# EasyEDA Pro project Charger Splitter.eprj, schematic Schematic3

## Sheets
1 P1: Board Name: Board3; Create Date: 2025-09-04; Page Name: P3; Project Name: Charger Splitter; Schematic Name: Schematic3; Update Date: 2025-09-05; Company: EasyEDA.com; Page Size: A4; Version: V1.0
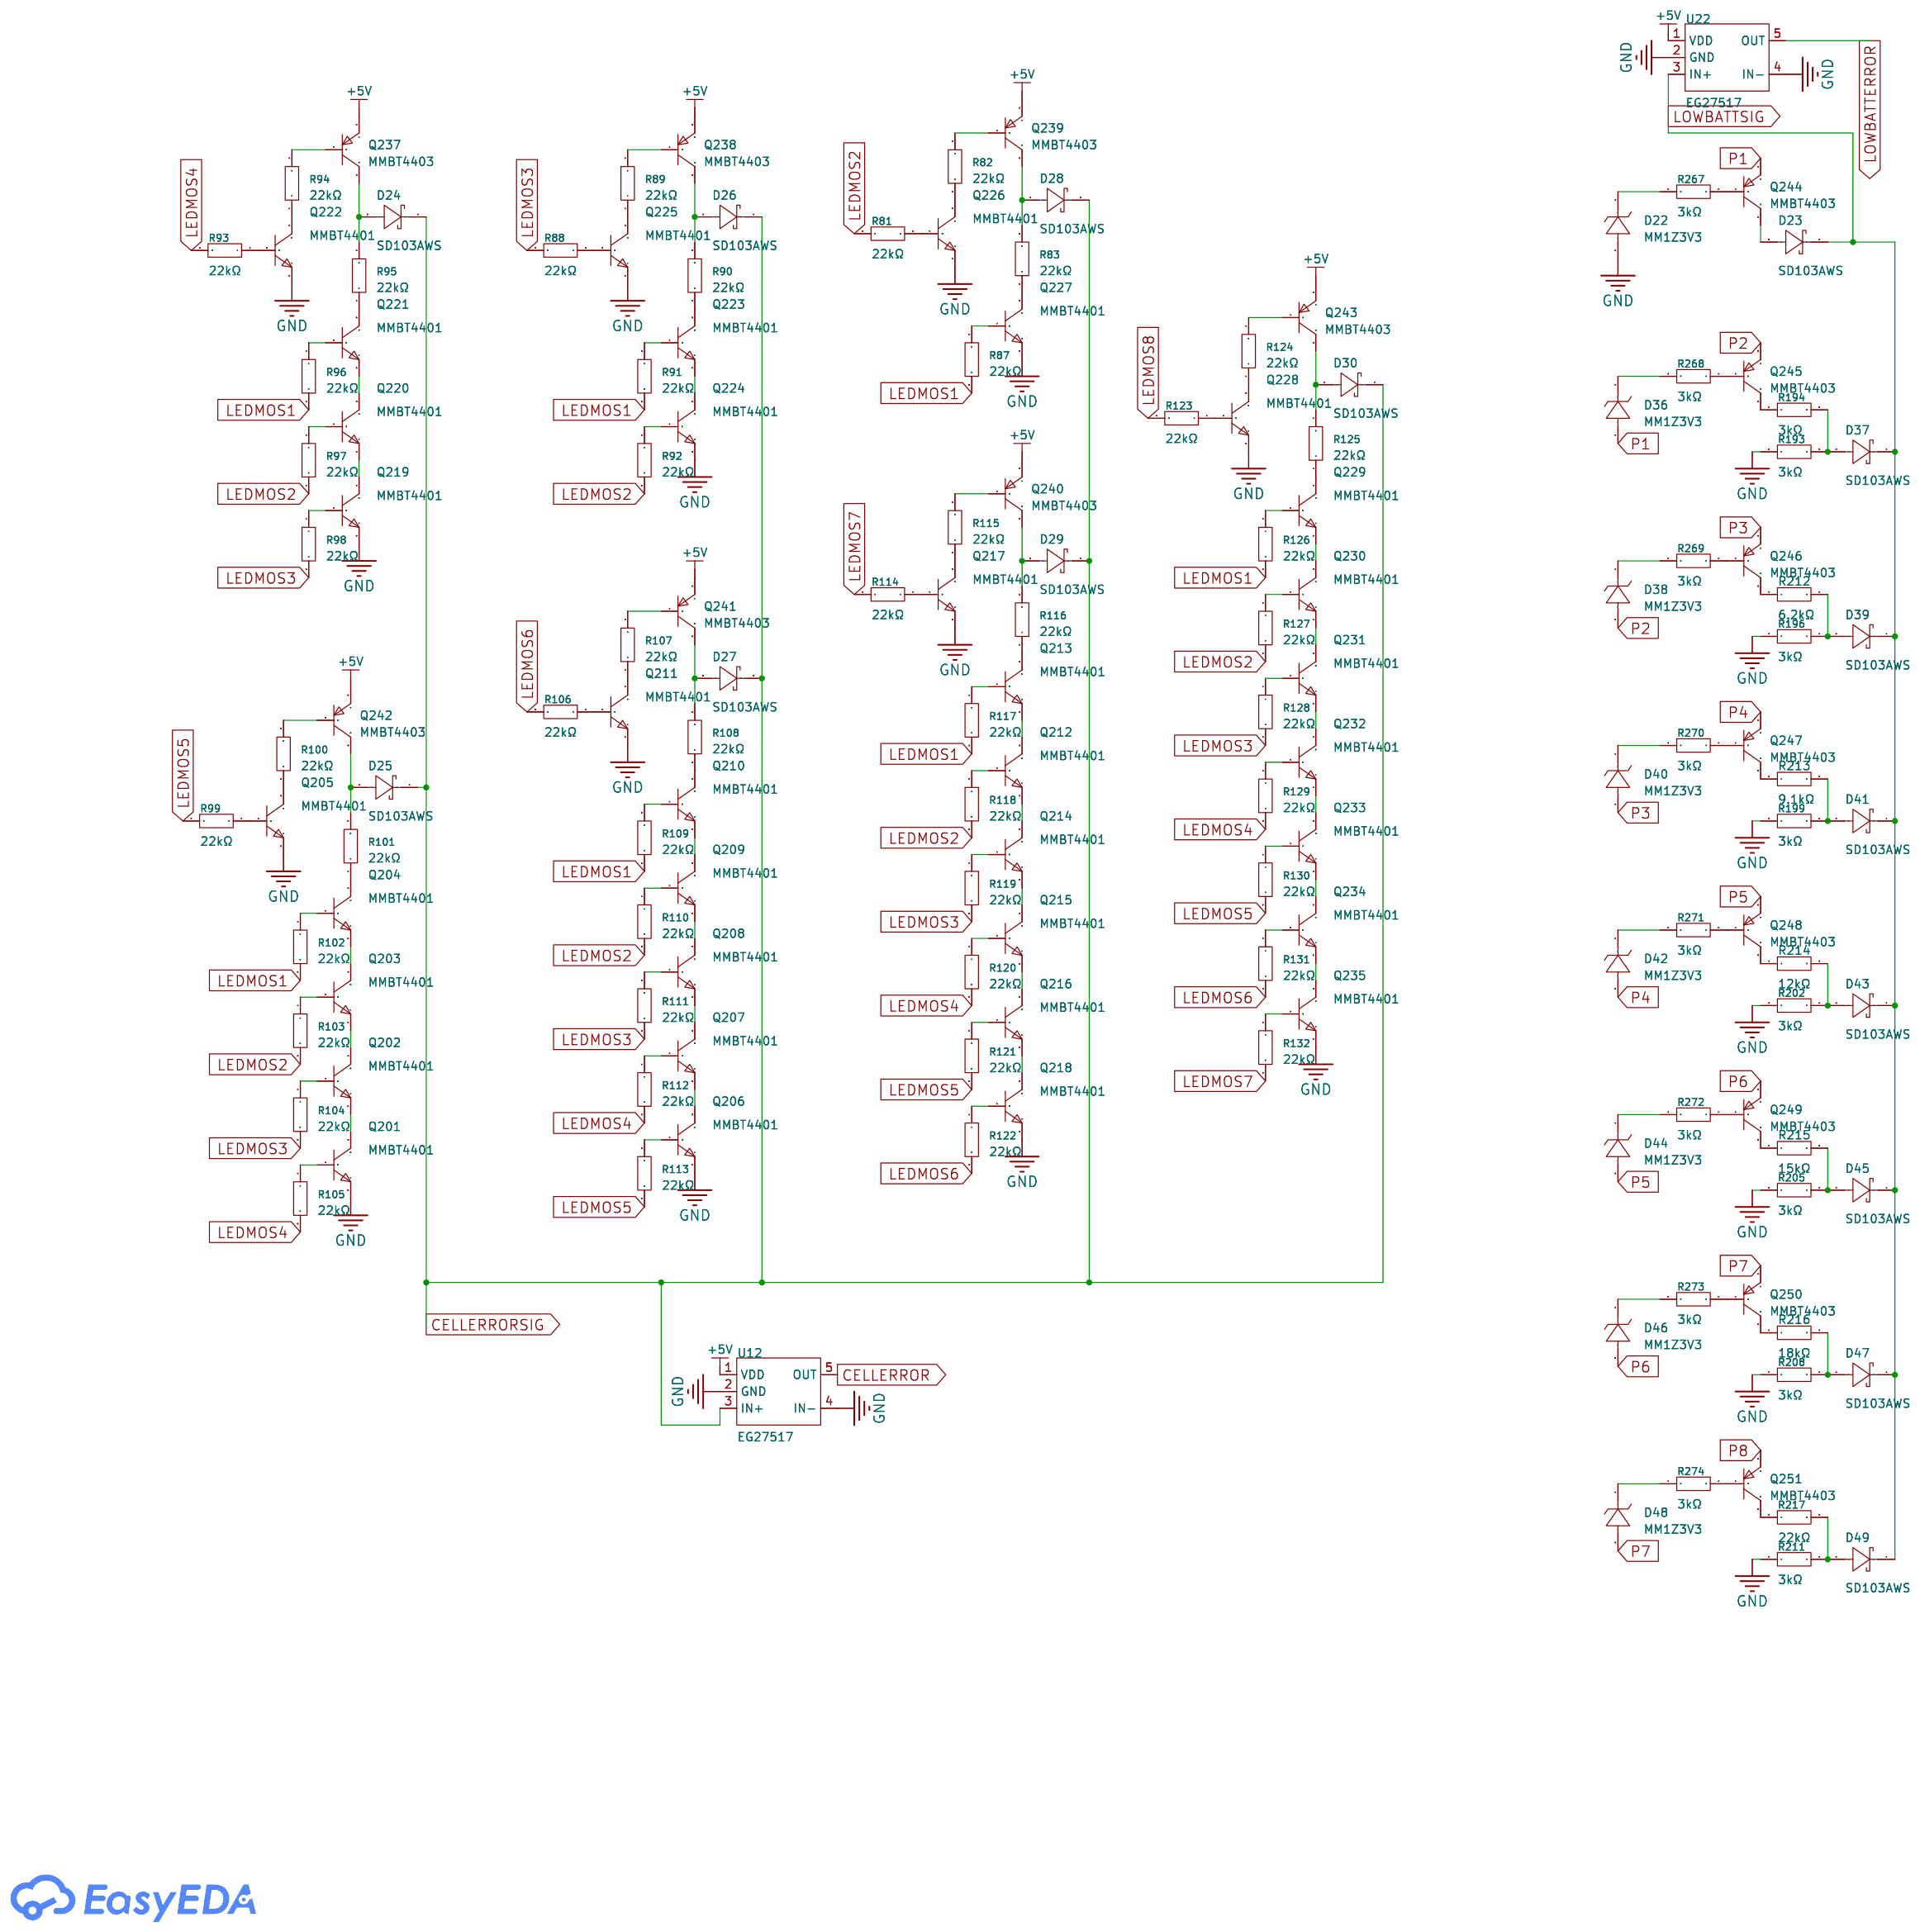
[diagram p2: P1]
2 P2: Page Name: P2; Update Date: 2025-09-13
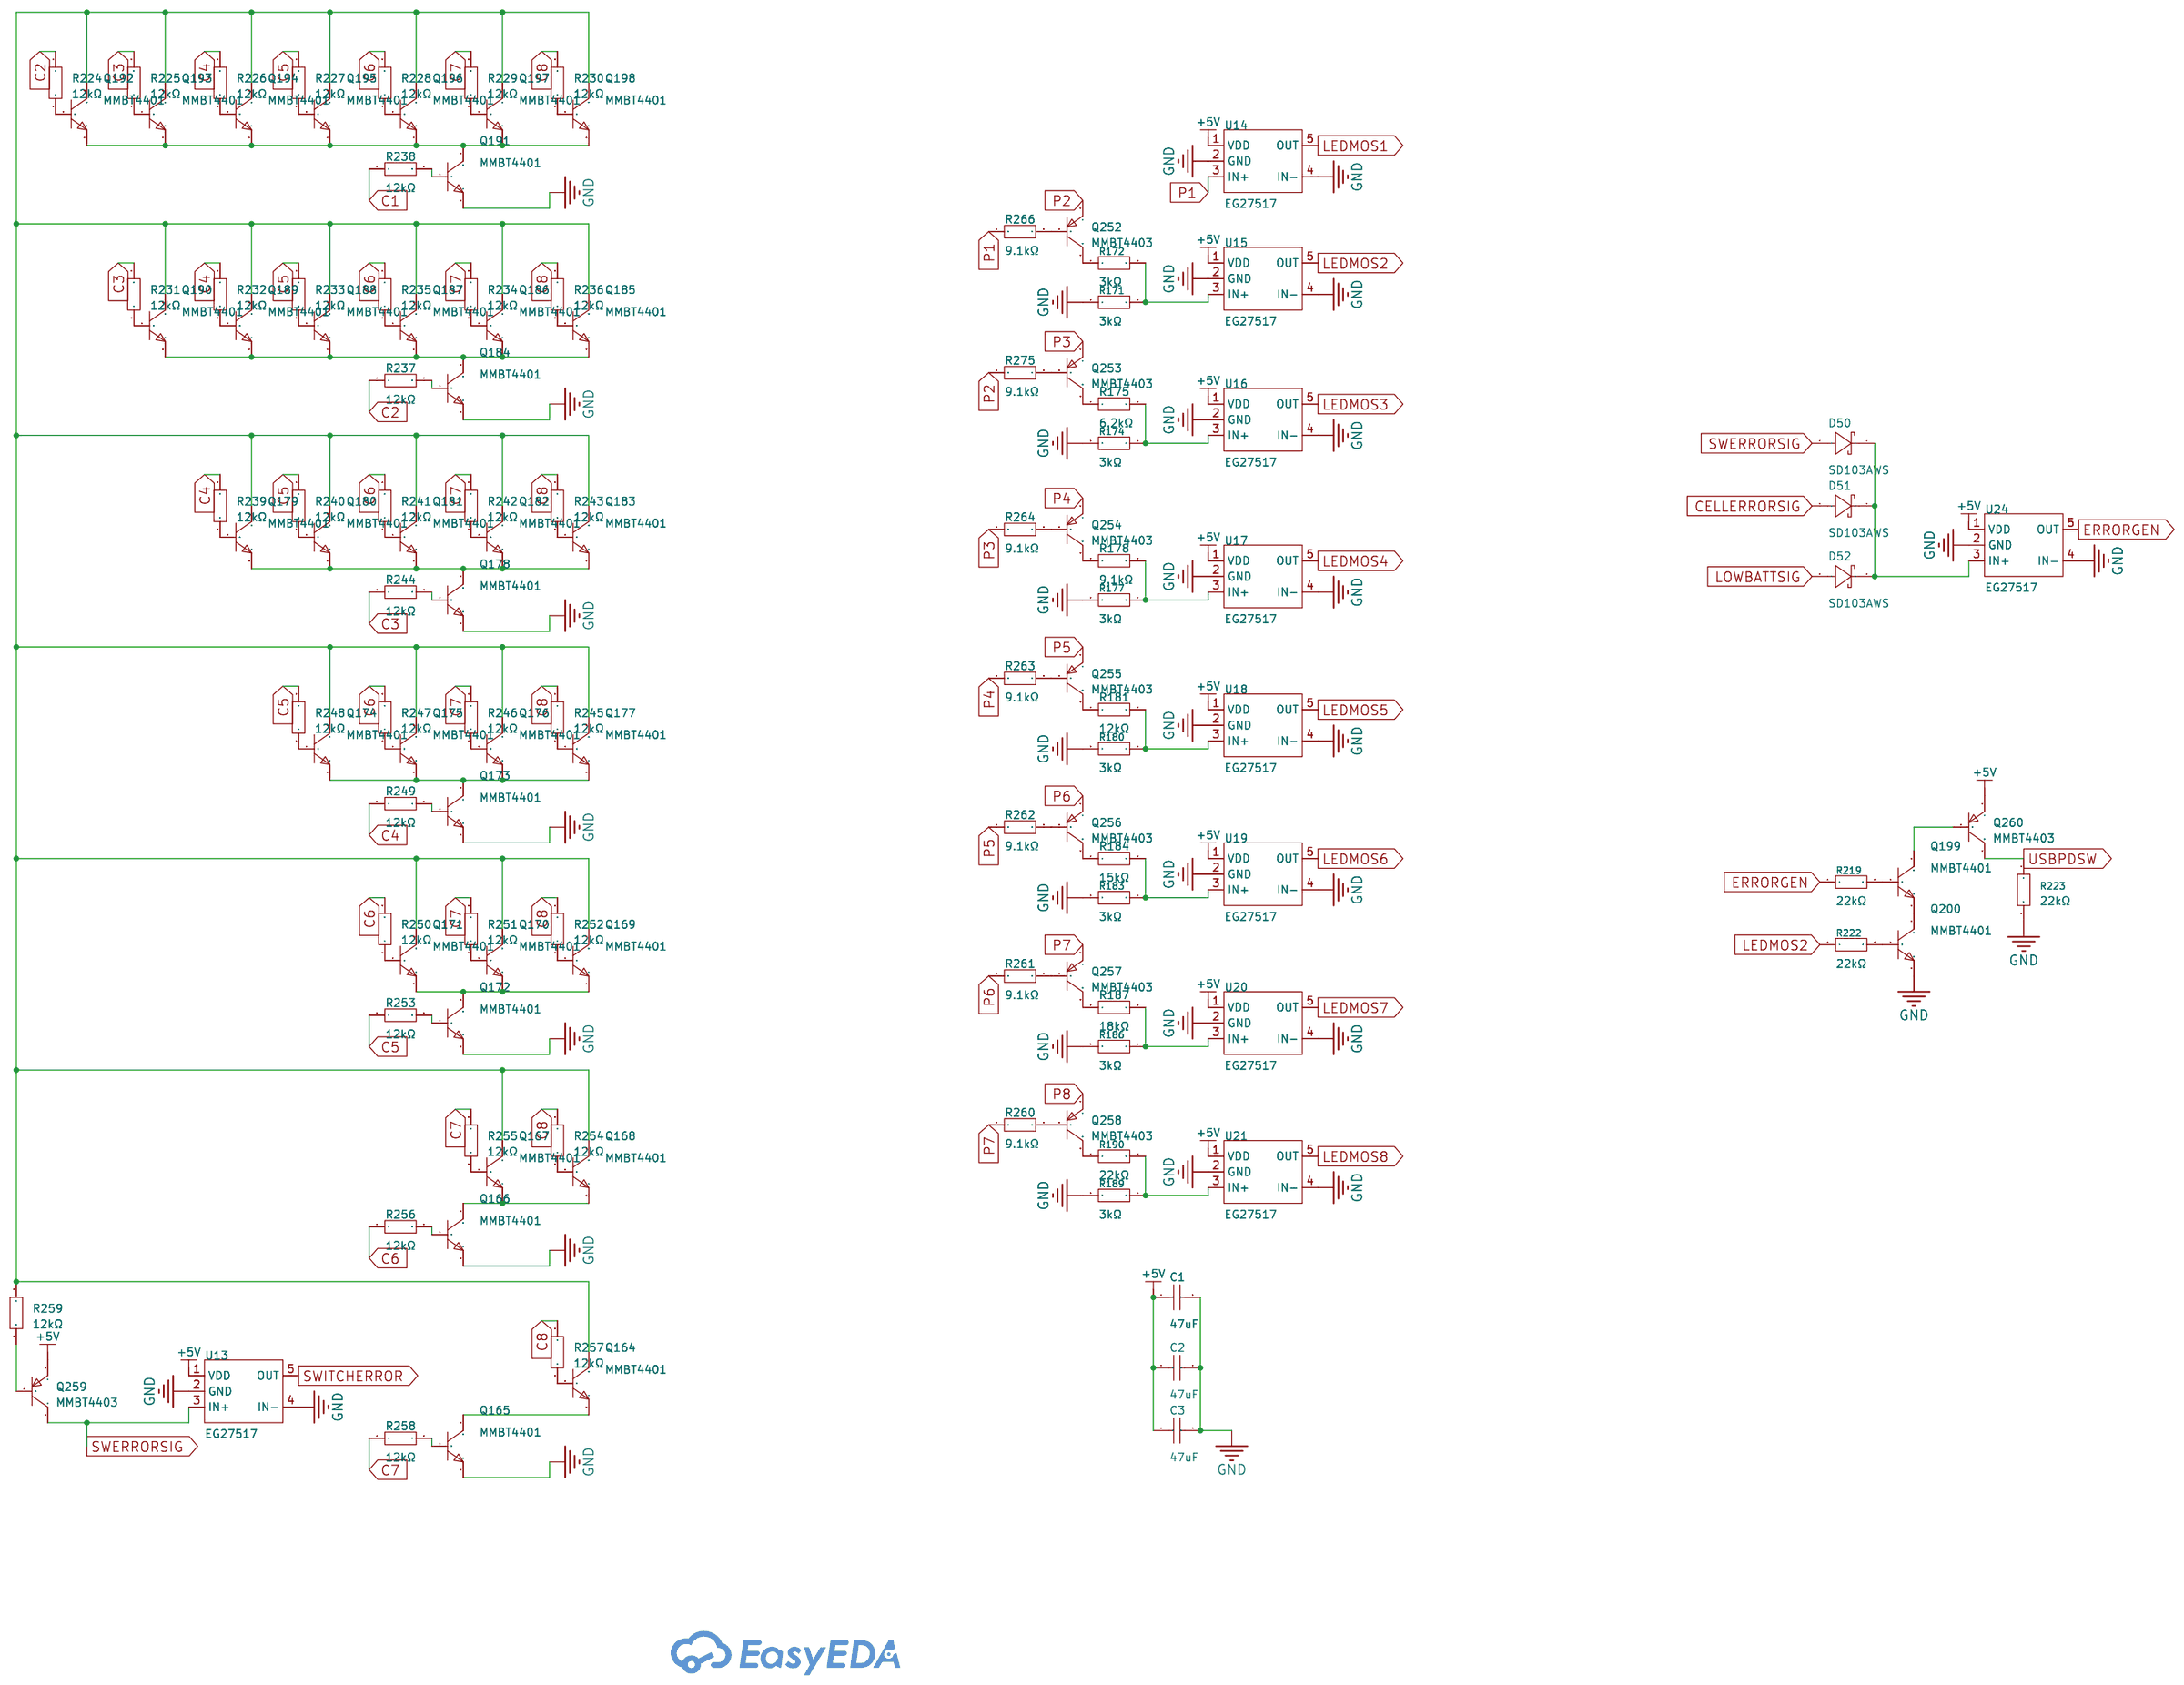
[diagram p3: P2]

## Parts
sheet P1
D22  MM1Z3V3  [SOD-123_L2.7-W1.6-LS3.7-RD]
D23  SD103AWS  [SOD-323_L1.7-W1.3-LS2.6-RD-1]
D24  SD103AWS  [SOD-323_L1.7-W1.3-LS2.6-RD-1]
D25  SD103AWS  [SOD-323_L1.7-W1.3-LS2.6-RD-1]
D26  SD103AWS  [SOD-323_L1.7-W1.3-LS2.6-RD-1]
D27  SD103AWS  [SOD-323_L1.7-W1.3-LS2.6-RD-1]
D28  SD103AWS  [SOD-323_L1.7-W1.3-LS2.6-RD-1]
D29  SD103AWS  [SOD-323_L1.7-W1.3-LS2.6-RD-1]
D30  SD103AWS  [SOD-323_L1.7-W1.3-LS2.6-RD-1]
D36  MM1Z3V3  [SOD-123_L2.7-W1.6-LS3.7-RD]
D37  SD103AWS  [SOD-323_L1.7-W1.3-LS2.6-RD-1]
D38  MM1Z3V3  [SOD-123_L2.7-W1.6-LS3.7-RD]
D39  SD103AWS  [SOD-323_L1.7-W1.3-LS2.6-RD-1]
D40  MM1Z3V3  [SOD-123_L2.7-W1.6-LS3.7-RD]
D41  SD103AWS  [SOD-323_L1.7-W1.3-LS2.6-RD-1]
D42  MM1Z3V3  [SOD-123_L2.7-W1.6-LS3.7-RD]
D43  SD103AWS  [SOD-323_L1.7-W1.3-LS2.6-RD-1]
D44  MM1Z3V3  [SOD-123_L2.7-W1.6-LS3.7-RD]
D45  SD103AWS  [SOD-323_L1.7-W1.3-LS2.6-RD-1]
D46  MM1Z3V3  [SOD-123_L2.7-W1.6-LS3.7-RD]
D47  SD103AWS  [SOD-323_L1.7-W1.3-LS2.6-RD-1]
D48  MM1Z3V3  [SOD-123_L2.7-W1.6-LS3.7-RD]
D49  SD103AWS  [SOD-323_L1.7-W1.3-LS2.6-RD-1]
Q201  MMBT4401  [SOT-23-3_L2.9-W1.3-P1.90-LS2.4-BR]
Q202  MMBT4401  [SOT-23-3_L2.9-W1.3-P1.90-LS2.4-BR]
Q203  MMBT4401  [SOT-23-3_L2.9-W1.3-P1.90-LS2.4-BR]
Q204  MMBT4401  [SOT-23-3_L2.9-W1.3-P1.90-LS2.4-BR]
Q205  MMBT4401  [SOT-23-3_L2.9-W1.3-P1.90-LS2.4-BR]
Q206  MMBT4401  [SOT-23-3_L2.9-W1.3-P1.90-LS2.4-BR]
Q207  MMBT4401  [SOT-23-3_L2.9-W1.3-P1.90-LS2.4-BR]
Q208  MMBT4401  [SOT-23-3_L2.9-W1.3-P1.90-LS2.4-BR]
Q209  MMBT4401  [SOT-23-3_L2.9-W1.3-P1.90-LS2.4-BR]
Q210  MMBT4401  [SOT-23-3_L2.9-W1.3-P1.90-LS2.4-BR]
Q211  MMBT4401  [SOT-23-3_L2.9-W1.3-P1.90-LS2.4-BR]
Q212  MMBT4401  [SOT-23-3_L2.9-W1.3-P1.90-LS2.4-BR]
Q213  MMBT4401  [SOT-23-3_L2.9-W1.3-P1.90-LS2.4-BR]
Q214  MMBT4401  [SOT-23-3_L2.9-W1.3-P1.90-LS2.4-BR]
Q215  MMBT4401  [SOT-23-3_L2.9-W1.3-P1.90-LS2.4-BR]
Q216  MMBT4401  [SOT-23-3_L2.9-W1.3-P1.90-LS2.4-BR]
Q217  MMBT4401  [SOT-23-3_L2.9-W1.3-P1.90-LS2.4-BR]
Q218  MMBT4401  [SOT-23-3_L2.9-W1.3-P1.90-LS2.4-BR]
Q219  MMBT4401  [SOT-23-3_L2.9-W1.3-P1.90-LS2.4-BR]
Q220  MMBT4401  [SOT-23-3_L2.9-W1.3-P1.90-LS2.4-BR]
Q221  MMBT4401  [SOT-23-3_L2.9-W1.3-P1.90-LS2.4-BR]
Q222  MMBT4401  [SOT-23-3_L2.9-W1.3-P1.90-LS2.4-BR]
Q223  MMBT4401  [SOT-23-3_L2.9-W1.3-P1.90-LS2.4-BR]
Q224  MMBT4401  [SOT-23-3_L2.9-W1.3-P1.90-LS2.4-BR]
Q225  MMBT4401  [SOT-23-3_L2.9-W1.3-P1.90-LS2.4-BR]
Q226  MMBT4401  [SOT-23-3_L2.9-W1.3-P1.90-LS2.4-BR]
Q227  MMBT4401  [SOT-23-3_L2.9-W1.3-P1.90-LS2.4-BR]
Q228  MMBT4401  [SOT-23-3_L2.9-W1.3-P1.90-LS2.4-BR]
Q229  MMBT4401  [SOT-23-3_L2.9-W1.3-P1.90-LS2.4-BR]
Q230  MMBT4401  [SOT-23-3_L2.9-W1.3-P1.90-LS2.4-BR]
Q231  MMBT4401  [SOT-23-3_L2.9-W1.3-P1.90-LS2.4-BR]
Q232  MMBT4401  [SOT-23-3_L2.9-W1.3-P1.90-LS2.4-BR]
Q233  MMBT4401  [SOT-23-3_L2.9-W1.3-P1.90-LS2.4-BR]
Q234  MMBT4401  [SOT-23-3_L2.9-W1.3-P1.90-LS2.4-BR]
Q235  MMBT4401  [SOT-23-3_L2.9-W1.3-P1.90-LS2.4-BR]
Q237  MMBT4403  [SOT-23-3_L2.9-W1.3-P0.95-LS2.4-BR]
Q238  MMBT4403  [SOT-23-3_L2.9-W1.3-P0.95-LS2.4-BR]
Q239  MMBT4403  [SOT-23-3_L2.9-W1.3-P0.95-LS2.4-BR]
Q240  MMBT4403  [SOT-23-3_L2.9-W1.3-P0.95-LS2.4-BR]
Q241  MMBT4403  [SOT-23-3_L2.9-W1.3-P0.95-LS2.4-BR]
Q242  MMBT4403  [SOT-23-3_L2.9-W1.3-P0.95-LS2.4-BR]
Q243  MMBT4403  [SOT-23-3_L2.9-W1.3-P0.95-LS2.4-BR]
Q244  MMBT4403  [SOT-23-3_L2.9-W1.3-P0.95-LS2.4-BR]
Q245  MMBT4403  [SOT-23-3_L2.9-W1.3-P0.95-LS2.4-BR]
Q246  MMBT4403  [SOT-23-3_L2.9-W1.3-P0.95-LS2.4-BR]
Q247  MMBT4403  [SOT-23-3_L2.9-W1.3-P0.95-LS2.4-BR]
Q248  MMBT4403  [SOT-23-3_L2.9-W1.3-P0.95-LS2.4-BR]
Q249  MMBT4403  [SOT-23-3_L2.9-W1.3-P0.95-LS2.4-BR]
Q250  MMBT4403  [SOT-23-3_L2.9-W1.3-P0.95-LS2.4-BR]
Q251  MMBT4403  [SOT-23-3_L2.9-W1.3-P0.95-LS2.4-BR]
R81  22kΩ  [R0603]
R82  22kΩ  [R0603]
R83  22kΩ  [R0603]
R87  22kΩ  [R0603]
R88  22kΩ  [R0603]
R89  22kΩ  [R0603]
R90  22kΩ  [R0603]
R91  22kΩ  [R0603]
R92  22kΩ  [R0603]
R93  22kΩ  [R0603]
R94  22kΩ  [R0603]
R95  22kΩ  [R0603]
R96  22kΩ  [R0603]
R97  22kΩ  [R0603]
R98  22kΩ  [R0603]
R99  22kΩ  [R0603]
R100  22kΩ  [R0603]
R101  22kΩ  [R0603]
R102  22kΩ  [R0603]
R103  22kΩ  [R0603]
R104  22kΩ  [R0603]
R105  22kΩ  [R0603]
R106  22kΩ  [R0603]
R107  22kΩ  [R0603]
R108  22kΩ  [R0603]
R109  22kΩ  [R0603]
R110  22kΩ  [R0603]
R111  22kΩ  [R0603]
R112  22kΩ  [R0603]
R113  22kΩ  [R0603]
R114  22kΩ  [R0603]
R115  22kΩ  [R0603]
R116  22kΩ  [R0603]
R117  22kΩ  [R0603]
R118  22kΩ  [R0603]
R119  22kΩ  [R0603]
R120  22kΩ  [R0603]
R121  22kΩ  [R0603]
R122  22kΩ  [R0603]
R123  22kΩ  [R0603]
R124  22kΩ  [R0603]
R125  22kΩ  [R0603]
R126  22kΩ  [R0603]
R127  22kΩ  [R0603]
R128  22kΩ  [R0603]
R129  22kΩ  [R0603]
R130  22kΩ  [R0603]
R131  22kΩ  [R0603]
R132  22kΩ  [R0603]
R193  3kΩ  [R0603]
R194  3kΩ  [R0603]
R196  3kΩ  [R0603]
R199  3kΩ  [R0603]
R202  3kΩ  [R0603]
R205  3kΩ  [R0603]
R208  3kΩ  [R0603]
R211  3kΩ  [R0603]
R212  6.2kΩ  [R0603]
R213  9.1kΩ  [R0603]
R214  12kΩ  [R0603]
R215  15kΩ  [R0603]
R216  18kΩ  [R0603]
R217  22kΩ  [R0603]
R267  3kΩ  [R0603]
R268  3kΩ  [R0603]
R269  3kΩ  [R0603]
R270  3kΩ  [R0603]
R271  3kΩ  [R0603]
R272  3kΩ  [R0603]
R273  3kΩ  [R0603]
R274  3kΩ  [R0603]
U12  EG27517  [SOT-23-5_L2.9-W1.6-P0.95-LS2.8-BR]
U22  EG27517  [SOT-23-5_L2.9-W1.6-P0.95-LS2.8-BR]
sheet P2
C1  47uF  [C0805]
C2  47uF  [C0805]
C3  47uF  [C0805]
D50  SD103AWS  [SOD-323_L1.7-W1.3-LS2.6-RD-1]
D51  SD103AWS  [SOD-323_L1.7-W1.3-LS2.6-RD-1]
D52  SD103AWS  [SOD-323_L1.7-W1.3-LS2.6-RD-1]
Q164  MMBT4401  [SOT-23-3_L2.9-W1.3-P1.90-LS2.4-BR]
Q165  MMBT4401  [SOT-23-3_L2.9-W1.3-P1.90-LS2.4-BR]
Q166  MMBT4401  [SOT-23-3_L2.9-W1.3-P1.90-LS2.4-BR]
Q167  MMBT4401  [SOT-23-3_L2.9-W1.3-P1.90-LS2.4-BR]
Q168  MMBT4401  [SOT-23-3_L2.9-W1.3-P1.90-LS2.4-BR]
Q169  MMBT4401  [SOT-23-3_L2.9-W1.3-P1.90-LS2.4-BR]
Q170  MMBT4401  [SOT-23-3_L2.9-W1.3-P1.90-LS2.4-BR]
Q171  MMBT4401  [SOT-23-3_L2.9-W1.3-P1.90-LS2.4-BR]
Q172  MMBT4401  [SOT-23-3_L2.9-W1.3-P1.90-LS2.4-BR]
Q173  MMBT4401  [SOT-23-3_L2.9-W1.3-P1.90-LS2.4-BR]
Q174  MMBT4401  [SOT-23-3_L2.9-W1.3-P1.90-LS2.4-BR]
Q175  MMBT4401  [SOT-23-3_L2.9-W1.3-P1.90-LS2.4-BR]
Q176  MMBT4401  [SOT-23-3_L2.9-W1.3-P1.90-LS2.4-BR]
Q177  MMBT4401  [SOT-23-3_L2.9-W1.3-P1.90-LS2.4-BR]
Q178  MMBT4401  [SOT-23-3_L2.9-W1.3-P1.90-LS2.4-BR]
Q179  MMBT4401  [SOT-23-3_L2.9-W1.3-P1.90-LS2.4-BR]
Q180  MMBT4401  [SOT-23-3_L2.9-W1.3-P1.90-LS2.4-BR]
Q181  MMBT4401  [SOT-23-3_L2.9-W1.3-P1.90-LS2.4-BR]
Q182  MMBT4401  [SOT-23-3_L2.9-W1.3-P1.90-LS2.4-BR]
Q183  MMBT4401  [SOT-23-3_L2.9-W1.3-P1.90-LS2.4-BR]
Q184  MMBT4401  [SOT-23-3_L2.9-W1.3-P1.90-LS2.4-BR]
Q185  MMBT4401  [SOT-23-3_L2.9-W1.3-P1.90-LS2.4-BR]
Q186  MMBT4401  [SOT-23-3_L2.9-W1.3-P1.90-LS2.4-BR]
Q187  MMBT4401  [SOT-23-3_L2.9-W1.3-P1.90-LS2.4-BR]
Q188  MMBT4401  [SOT-23-3_L2.9-W1.3-P1.90-LS2.4-BR]
Q189  MMBT4401  [SOT-23-3_L2.9-W1.3-P1.90-LS2.4-BR]
Q190  MMBT4401  [SOT-23-3_L2.9-W1.3-P1.90-LS2.4-BR]
Q191  MMBT4401  [SOT-23-3_L2.9-W1.3-P1.90-LS2.4-BR]
Q192  MMBT4401  [SOT-23-3_L2.9-W1.3-P1.90-LS2.4-BR]
Q193  MMBT4401  [SOT-23-3_L2.9-W1.3-P1.90-LS2.4-BR]
Q194  MMBT4401  [SOT-23-3_L2.9-W1.3-P1.90-LS2.4-BR]
Q195  MMBT4401  [SOT-23-3_L2.9-W1.3-P1.90-LS2.4-BR]
Q196  MMBT4401  [SOT-23-3_L2.9-W1.3-P1.90-LS2.4-BR]
Q197  MMBT4401  [SOT-23-3_L2.9-W1.3-P1.90-LS2.4-BR]
Q198  MMBT4401  [SOT-23-3_L2.9-W1.3-P1.90-LS2.4-BR]
Q199  MMBT4401  [SOT-23-3_L2.9-W1.3-P1.90-LS2.4-BR]
Q200  MMBT4401  [SOT-23-3_L2.9-W1.3-P1.90-LS2.4-BR]
Q252  MMBT4403  [SOT-23-3_L2.9-W1.3-P0.95-LS2.4-BR]
Q253  MMBT4403  [SOT-23-3_L2.9-W1.3-P0.95-LS2.4-BR]
Q254  MMBT4403  [SOT-23-3_L2.9-W1.3-P0.95-LS2.4-BR]
Q255  MMBT4403  [SOT-23-3_L2.9-W1.3-P0.95-LS2.4-BR]
Q256  MMBT4403  [SOT-23-3_L2.9-W1.3-P0.95-LS2.4-BR]
Q257  MMBT4403  [SOT-23-3_L2.9-W1.3-P0.95-LS2.4-BR]
Q258  MMBT4403  [SOT-23-3_L2.9-W1.3-P0.95-LS2.4-BR]
Q259  MMBT4403  [SOT-23-3_L2.9-W1.3-P0.95-LS2.4-BR]
Q260  MMBT4403  [SOT-23-3_L2.9-W1.3-P0.95-LS2.4-BR]
R171  3kΩ  [R0603]
R172  3kΩ  [R0603]
R174  3kΩ  [R0603]
R175  6.2kΩ  [R0603]
R177  3kΩ  [R0603]
R178  9.1kΩ  [R0603]
R180  3kΩ  [R0603]
R181  12kΩ  [R0603]
R183  3kΩ  [R0603]
R184  15kΩ  [R0603]
R186  3kΩ  [R0603]
R187  18kΩ  [R0603]
R189  3kΩ  [R0603]
R190  22kΩ  [R0603]
R219  22kΩ  [R0603]
R222  22kΩ  [R0603]
R223  22kΩ  [R0603]
R224  12kΩ  [R0603]
R225  12kΩ  [R0603]
R226  12kΩ  [R0603]
R227  12kΩ  [R0603]
R228  12kΩ  [R0603]
R229  12kΩ  [R0603]
R230  12kΩ  [R0603]
R231  12kΩ  [R0603]
R232  12kΩ  [R0603]
R233  12kΩ  [R0603]
R234  12kΩ  [R0603]
R235  12kΩ  [R0603]
R236  12kΩ  [R0603]
R237  12kΩ  [R0603]
R238  12kΩ  [R0603]
R239  12kΩ  [R0603]
R240  12kΩ  [R0603]
R241  12kΩ  [R0603]
R242  12kΩ  [R0603]
R243  12kΩ  [R0603]
R244  12kΩ  [R0603]
R245  12kΩ  [R0603]
R246  12kΩ  [R0603]
R247  12kΩ  [R0603]
R248  12kΩ  [R0603]
R249  12kΩ  [R0603]
R250  12kΩ  [R0603]
R251  12kΩ  [R0603]
R252  12kΩ  [R0603]
R253  12kΩ  [R0603]
R254  12kΩ  [R0603]
R255  12kΩ  [R0603]
R256  12kΩ  [R0603]
R257  12kΩ  [R0603]
R258  12kΩ  [R0603]
R259  12kΩ  [R0603]
R260  9.1kΩ  [R0603]
R261  9.1kΩ  [R0603]
R262  9.1kΩ  [R0603]
R263  9.1kΩ  [R0603]
R264  9.1kΩ  [R0603]
R266  9.1kΩ  [R0603]
R275  9.1kΩ  [R0603]
U13  EG27517  [SOT-23-5_L2.9-W1.6-P0.95-LS2.8-BR]
U14  EG27517  [SOT-23-5_L2.9-W1.6-P0.95-LS2.8-BR]
U15  EG27517  [SOT-23-5_L2.9-W1.6-P0.95-LS2.8-BR]
U16  EG27517  [SOT-23-5_L2.9-W1.6-P0.95-LS2.8-BR]
U17  EG27517  [SOT-23-5_L2.9-W1.6-P0.95-LS2.8-BR]
U18  EG27517  [SOT-23-5_L2.9-W1.6-P0.95-LS2.8-BR]
U19  EG27517  [SOT-23-5_L2.9-W1.6-P0.95-LS2.8-BR]
U20  EG27517  [SOT-23-5_L2.9-W1.6-P0.95-LS2.8-BR]
U21  EG27517  [SOT-23-5_L2.9-W1.6-P0.95-LS2.8-BR]
U24  EG27517  [SOT-23-5_L2.9-W1.6-P0.95-LS2.8-BR]

## Library data of the parts
D22 D36 D38 D40 D42 D44 D46 D48 = MM1Z3V3_C22379456: LCSC Part Name: 独立式 耐压:3.3V 电流:20uA@1V; Supplier Part: C22379456; Manufacturer: 宏嘉诚; Supplier Footprint: SOD-123; JLCPCB Part Class: Extended Part; Datasheet: https://item.szlcsc.com/datasheet/MM1Z3V3/23902936.html; Supplier: LCSC; Diode Configuration: Independent; Zener Voltage(Nom): 3.3V; Reverse Leakage Current (Ir): 20uA@1V; Zener Voltage(Range): 3.1V~3.5V; Pd - Power Dissipation: 500mW; Impedance(Zzt): 130Ω; Operating Junction Temperature Range: -55℃~+150℃
D23-D30 D37 D39 D41 D43 D45 D47 D49-D52 = SD103AWS_C7420360: LCSC Part Name: 电压:40V 电流:350mA; Supplier Part: C7420360; Manufacturer: 宏迦橙; Supplier Footprint: SOD-323; JLCPCB Part Class: Extended Part; Datasheet: https://atta.szlcsc.com/upload/public/pdf/source/20230828/EB98D42952FEC013AACB2F62A2475546.pdf; Supplier: LCSC; Diode Configuration: Single; Forward Voltage (Vf@If): 370mV@20mA; Reverse Voltage (Vr): 40V; Average Rectified Current (Io): 350mA; Reverse Leakage Current (Ir): 5uA@40V; Peak forward surge current: 1.5A
Q164-Q235 = MMBT4401_C7420355: LCSC Part Name: hFE:100-300 MMBT4401; Supplier Part: C7420355; Manufacturer: R+O(宏嘉诚); Supplier Footprint: SOT-23; JLCPCB Part Class: Extended Part; Datasheet: https://item.szlcsc.com/datasheet/MMBT4401/8397177.html; Supplier: LCSC; type: NPN; Current - Collector(Ic): 600mA; Collector - Emitter Voltage VCEO: 40V; Pd - Power Dissipation: 300mW; DC Current Gain: 100@150mA,1.0V; Transition frequency(fT): 250MHz; Current - Collector Cutoff: 100nA; Vce Saturation(VCE(sat)): 400mV@150mA,15mA; Operating Temperature: -55℃~+150℃
Q237-Q260 = MMBT4403_C20069140: LCSC Part Name: hFE:100-300 PNP 电流:600mA 电压:40V; Supplier Part: C20069140; Manufacturer: R+O(宏嘉诚); Supplier Footprint: SOT-23; JLCPCB Part Class: Extended Part; Datasheet: https://item.szlcsc.com/datasheet/MMBT4403/21397178.html; Supplier: LCSC; type: PNP; Current - Collector(Ic): 600mA; Collector - Emitter Voltage VCEO: 40V; Pd - Power Dissipation: 300mW; DC Current Gain: 100@10mA,1.0V; Transition frequency(fT): 200MHz; Current - Collector Cutoff: 100nA; Vce Saturation(VCE(sat)): 400mV; Operating Temperature: -55℃~+150℃; Emitter-Base Voltage(Vebo): 5V
R81-R83 R87-R132 R190 R217 R219 R222 R223 = 0603WAF2202T5E: Type:Thick Film Resistors Resistance:22kΩ Tolerance:±1% Tolerance:±1% Power(Watts): Overload Voltage (Max): Temperature Coefficient:±100ppm/℃ Temperature Coefficient:±100ppm/℃ Operating Temperature Range:-55℃~+155℃ Operating Temperature Range:-55℃~+155℃; LCSC Part Name: 22kΩ ±1% 100mW 厚膜电阻; Supplier Part: C31850; Manufacturer: UNI-ROYAL(厚声); Supplier Footprint: 0603; JLCPCB Part Class: Basic Part; Datasheet: https://atta.szlcsc.com/upload/public/pdf/source/20200306/C422600_1E6D84923E4A46A82E41ADD87F860B5C.pdf; Supplier: LCSC; Type: Thick Film Resistors; Tolerance: ±1%; Temperature Coefficient: ±100ppm/℃; Operating Temperature Range: -55℃~+155℃
R171 R172 R174 R177 R180 R183 R186 R189 R193 R194 R196 R199 R202 R205 R208 R211 R267-R274 = 0603WAF3001T5E: Type:Thick Film Resistor Resistance:3kΩ Tolerance:±1% Tolerance:±1% Power(Watts):100mW Voltage-Supply(Max):75V Temperature Coefficient:±100ppm/℃ Temperature Coefficient:±100ppm/℃ Operating Temperature:-55℃~+155℃ Operating Temperature:-55℃~+155℃; LCSC Part Name: 3kΩ ±1% 100mW 厚膜电阻; Supplier Part: C4211; Manufacturer: UNI-ROYAL(厚声); Supplier Footprint: 0603; JLCPCB Part Class: Basic Part; Datasheet: https://item.szlcsc.com/datasheet/0603WAF3001T5E/4618.html; Supplier: LCSC; Type: Thick Film Resistor; Tolerance: ±1%; Power(Watts): 100mW; Voltage-Supply(Max): 75V; Temperature Coefficient: ±100ppm/℃; Operating Temperature: -55℃~+155℃
R175 R212 = 0603WAF6201T5E: Type:Thick Film Resistor Resistance:6.2kΩ Tolerance:±1% Tolerance:±1% Power(Watts):100mW Voltage-Supply(Max):75V Temperature Coefficient:±100ppm/℃ Temperature Coefficient:±100ppm/℃ Operating Temperature:-55℃~+155℃ Operating Temperature:-55℃~+155℃; LCSC Part Name: 6.2kΩ ±1% 100mW 厚膜电阻; Supplier Part: C4260; Manufacturer: UNI-ROYAL(厚声); Supplier Footprint: 0603; JLCPCB Part Class: Basic Part; Datasheet: https://item.szlcsc.com/datasheet/0603WAF6201T5E/4667.html; Supplier: LCSC; Type: Thick Film Resistor; Tolerance: ±1%; Power(Watts): 100mW; Voltage-Supply(Max): 75V; Temperature Coefficient: ±100ppm/℃; Operating Temperature: -55℃~+155℃
R178 R213 R260-R264 R266 R275 = 0603WAF9101T5E: Type:Thick Film Resistor Resistance:9.1kΩ Tolerance:±1% Tolerance:±1% Power(Watts):100mW Voltage-Supply(Max):75V Temperature Coefficient:±100ppm/℃ Temperature Coefficient:±100ppm/℃ Operating Temperature:-55℃~+155℃ Operating Temperature:-55℃~+155℃; LCSC Part Name: 9.1kΩ ±1% 100mW 厚膜电阻; Supplier Part: C23260; Manufacturer: UNI-ROYAL(厚声); Supplier Footprint: 0603; JLCPCB Part Class: Basic Part; Datasheet: https://item.szlcsc.com/datasheet/0603WAF9101T5E/23987.html; Supplier: LCSC; Type: Thick Film Resistor; Tolerance: ±1%; Power(Watts): 100mW; Voltage-Supply(Max): 75V; Temperature Coefficient: ±100ppm/℃; Operating Temperature: -55℃~+155℃
R181 R214 R224-R259 = 0603WAF1202T5E: Type:Thick Film Resistor Resistance:12kΩ Tolerance:±1% Tolerance:±1% Power(Watts):100mW Voltage-Supply(Max):75V Temperature Coefficient:±100ppm/℃ Temperature Coefficient:±100ppm/℃ Operating Temperature:-55℃~+155℃ Operating Temperature:-55℃~+155℃; LCSC Part Name: 12kΩ ±1% 100mW 厚膜电阻; Supplier Part: C22790; Manufacturer: UNI-ROYAL(厚声); Supplier Footprint: 0603; JLCPCB Part Class: Basic Part; Datasheet: https://item.szlcsc.com/datasheet/0603WAF1202T5E/23517.html; Supplier: LCSC; Type: Thick Film Resistor; Tolerance: ±1%; Power(Watts): 100mW; Voltage-Supply(Max): 75V; Temperature Coefficient: ±100ppm/℃; Operating Temperature: -55℃~+155℃
R184 R215 = 0603WAF1502T5E: Type:Thick Film Resistor Resistance:15kΩ Tolerance:±1% Tolerance:±1% Power(Watts):100mW Voltage-Supply(Max):75V Temperature Coefficient:±100ppm/℃ Temperature Coefficient:±100ppm/℃ Operating Temperature:-55℃~+155℃ Operating Temperature:-55℃~+155℃; LCSC Part Name: 15kΩ ±1% 100mW 厚膜电阻; Supplier Part: C22809; Manufacturer: UNI-ROYAL(厚声); Supplier Footprint: 0603; JLCPCB Part Class: Basic Part; Datasheet: https://item.szlcsc.com/datasheet/0603WAF1502T5E/23536.html; Supplier: LCSC; Type: Thick Film Resistor; Tolerance: ±1%; Power(Watts): 100mW; Voltage-Supply(Max): 75V; Temperature Coefficient: ±100ppm/℃; Operating Temperature: -55℃~+155℃
R187 R216 = 0603WAF1802T5E: Type:Thick Film Resistor Resistance:18kΩ Tolerance:±1% Tolerance:±1% Power(Watts):100mW Voltage-Supply(Max):75V Temperature Coefficient:±100ppm/℃ Temperature Coefficient:±100ppm/℃ Operating Temperature:-55℃~+155℃ Operating Temperature:-55℃~+155℃; LCSC Part Name: 18kΩ ±1% 100mW 厚膜电阻; Supplier Part: C25810; Manufacturer: UNI-ROYAL(厚声); Supplier Footprint: 0603; JLCPCB Part Class: Basic Part; Datasheet: https://item.szlcsc.com/datasheet/0603WAF1802T5E/26553.html; Supplier: LCSC; Type: Thick Film Resistor; Tolerance: ±1%; Power(Watts): 100mW; Voltage-Supply(Max): 75V; Temperature Coefficient: ±100ppm/℃; Operating Temperature: -55℃~+155℃
U12-U22 U24 = EG27517: Driven Configuration:Low Side Load Type:MOSFET；IGBT Number of Drivers:1 Current - Output Low(IOL):4A Current - Output High(IOH):4A Voltage - Supply:4V~20V Voltage - Supply:4V~20V Rise Time:40ns Fall Time:20ns Operating Temperature:-45℃~+125℃ Operating Tem; LCSC Part Name: 高速低侧单通道驱动芯片; Supplier Part: C2987449; Manufacturer: EG(屹晶微); Supplier Footprint: SOT-23-5; JLCPCB Part Class: Extended Part; Datasheet: https://item.szlcsc.com/datasheet/EG27517/3440336.html; Supplier: LCSC; Driven Configuration: Low Side; Load Type: MOSFET；IGBT; Number of Drivers: 1; Current - Output Low(IOL): 4A; Current - Output High(IOH): 4A; Voltage - Supply: 4V~20V; Rise Time: 40ns; Fall Time: 20ns; Operating Temperature: -45℃~+125℃; Input Logic Level - Low: -300mV~1V; Quiescent Current(Iq): 10uA
C1-C3 = CL21A476MQYNNNE: LCSC Part Name: 47uF ±20% 6.3V; Supplier Part: C16780; Manufacturer: SAMSUNG(三星); Supplier Footprint: 0805; JLCPCB Part Class: Basic Part; Datasheet: https://item.szlcsc.com/datasheet/CL21A476MQYNNNE/17464.html; Supplier: LCSC; Tolerance: ±20%; Voltage Rating: 6.3V; Temperature Coefficient: X5R

## Nets
+5V: C1.1 C2.1 C3.1 Q237.2(E) Q238.2(E) Q239.2(E) Q240.2(E) Q241.2(E) Q242.2(E) Q243.2(E) Q259.2(E) Q260.2(E) U12.1(VDD) U13.1(VDD) U14.1(VDD) U15.1(VDD) U16.1(VDD) U17.1(VDD) U18.1(VDD) U19.1(VDD) U20.1(VDD) U21.1(VDD) U22.1(VDD) U24.1(VDD)
GND: C1.2 C2.2 C3.2 D22.2(A) Q165.2(E) Q166.2(E) Q172.2(E) Q173.2(E) Q178.2(E) Q184.2(E) Q191.2(E) Q200.2(E) Q201.2(E) Q205.2(E) Q206.2(E) Q211.2(E) Q217.2(E) Q218.2(E) Q219.2(E) Q222.2(E) Q224.2(E) Q225.2(E) Q226.2(E) Q227.2(E) Q228.2(E) Q235.2(E) R171.2 R174.2 R177.2 R180.2 R183.2 R186.2 R189.2 R193.2 R196.2 R199.2 R202.2 R205.2 R208.2 R211.2 R223.2 U12.2(GND) U12.4(IN-) U13.2(GND) U13.4(IN-) U14.2(GND) U14.4(IN-) U15.2(GND) U15.4(IN-) U16.2(GND) U16.4(IN-) U17.2(GND) U17.4(IN-) U18.2(GND) U18.4(IN-) U19.2(GND) U19.4(IN-) U20.2(GND) U20.4(IN-) U21.2(GND) U21.4(IN-) U22.2(GND) U22.4(IN-) U24.2(GND) U24.4(IN-)
C1: R238.1
C2: R224.2 R237.1
C3: R225.2 R231.2 R244.1
C4: R226.2 R232.1 R239.2 R249.1
C5: R227.2 R233.2 R240.2 R248.2 R253.1
C6: R228.2 R235.2 R241.2 R247.2 R250.2 R256.1
C7: R229.2 R234.2 R242.2 R246.2 R251.2 R255.2 R258.1
C8: R230.2 R236.2 R243.2 R245.2 R252.2 R254.2 R257.2
CELLERROR: U12.5(OUT)
CELLERRORSIG: D24.1(K) D25.1(K) D26.1(K) D27.1(K) D28.1(K) D29.1(K) D30.1(K) D51.2(A) U12.3(IN+)
ERRORGEN: R219.1 U24.5(OUT)
LEDMOS1: R87.2 R91.2 R96.2 R102.2 R109.2 R117.2 R126.2 U14.5(OUT)
LEDMOS2: R81.2 R92.2 R97.2 R103.2 R110.2 R118.2 R127.2 R222.1 U15.5(OUT)
LEDMOS3: R88.2 R98.2 R104.2 R111.2 R119.2 R128.2 U16.5(OUT)
LEDMOS4: R93.2 R105.2 R112.2 R120.2 R129.2 U17.5(OUT)
LEDMOS5: R99.2 R113.2 R121.2 R130.2 U18.5(OUT)
LEDMOS6: R106.2 R122.2 R131.2 U19.5(OUT)
LEDMOS7: R114.2 R132.2 U20.5(OUT)
LEDMOS8: R123.2 U21.5(OUT)
LOWBATTERROR: U22.5(OUT)
LOWBATTSIG: D23.1(K) D37.1(K) D39.1(K) D41.1(K) D43.1(K) D45.1(K) D47.1(K) D49.1(K) D52.2(A) U22.3(IN+)
P1: D36.2(A) Q244.2(E) R266.1 U14.3(IN+)
P2: D38.2(A) Q245.2(E) Q252.2(E) R275.1
P3: D40.2(A) Q246.2(E) Q253.2(E) R264.1
P4: D42.2(A) Q247.2(E) Q254.2(E) R263.1
P5: D44.2(A) Q248.2(E) Q255.2(E) R262.1
P6: D46.2(A) Q249.2(E) Q256.2(E) R261.1
P7: D48.2(A) Q250.2(E) Q257.2(E) R260.1
P8: Q251.2(E) Q258.2(E)
SWERRORSIG: D50.2(A) Q259.3(C) U13.3(IN+)
SWITCHERROR: U13.5(OUT)
USBPDSW: Q260.3(C) R223.1
$1N21279: Q239.1(B) R82.2
$1N21357: D28.2(A) Q239.3(C) R83.2
$1N25602: Q227.1(B) R87.1
$1N27046: Q238.1(B) R89.2
$1N27049: Q223.1(B) R91.1
$1N27054: D26.2(A) Q238.3(C) R90.2
$1N27150: Q224.1(B) R92.1
$1N27157: Q223.2(E) Q224.3(C)
$1N29440: D24.2(A) Q237.3(C) R95.2
$1N29442: Q237.1(B) R94.2
$1N29444: Q220.3(C) Q221.2(E)
$1N29448: Q220.1(B) R97.1
$1N29450: Q221.1(B) R96.1
$1N29549: Q219.1(B) R98.1
$1N29569: Q219.3(C) Q220.2(E)
$1N30119: Q202.3(C) Q203.2(E)
$1N30127: Q203.1(B) R103.1
$1N30129: Q202.1(B) R104.1
$1N30131: Q204.1(B) R102.1
$1N30133: Q203.3(C) Q204.2(E)
$1N30135: D25.2(A) Q242.3(C) R101.2
$1N30137: Q242.1(B) R100.2
$1N30234: Q201.1(B) R105.1
$1N30241: Q201.3(C) Q202.2(E)
$1N30920: Q208.1(B) R111.1
$1N30922: Q208.3(C) Q209.2(E)
$1N30924: Q210.1(B) R109.1
$1N30926: Q209.3(C) Q210.2(E)
$1N30928: Q209.1(B) R110.1
$1N30938: Q241.1(B) R107.2
$1N30939: D27.2(A) Q241.3(C) R108.2
$1N30943: Q207.3(C) Q208.2(E)
$1N30949: Q207.1(B) R112.1
$1N31050: Q206.1(B) R113.1
$1N31069: Q206.3(C) Q207.2(E)
$1N31779: Q212.3(C) Q213.2(E)
$1N31781: Q213.1(B) R117.1
$1N31784: D29.2(A) Q240.3(C) R116.2
$1N31785: Q240.1(B) R115.2
$1N31791: Q215.2(E) Q216.3(C)
$1N31793: Q215.1(B) R120.1
$1N31795: Q216.1(B) R121.1
$1N31799: Q212.1(B) R118.1
$1N31801: Q212.2(E) Q214.3(C)
$1N31803: Q214.1(B) R119.1
$1N31809: Q214.2(E) Q215.3(C)
$1N31922: Q218.1(B) R122.1
$1N31941: Q216.2(E) Q218.3(C)
$1N39505: Q233.2(E) Q234.3(C)
$1N39506: Q231.1(B) R128.1
$1N39508: Q231.2(E) Q232.3(C)
$1N39509: Q230.1(B) R127.1
$1N39511: Q230.2(E) Q231.3(C)
$1N39513: Q232.1(B) R129.1
$1N39516: Q229.1(B) R126.1
$1N39518: Q243.1(B) R124.2
$1N39519: Q232.2(E) Q233.3(C)
$1N39520: Q233.1(B) R130.1
$1N39523: Q234.1(B) R131.1
$1N39525: Q229.2(E) Q230.3(C)
$1N39527: D30.2(A) Q243.3(C) R125.2
$1N39630: Q235.1(B) R132.1
$1N53925: D22.1(K) R267.2
$1N54024: D23.2(A) Q244.3(C)
$1N61018: D36.1(K) R268.2
$1N61120: D37.2(A) R193.1 R194.2
$1N64738: D39.2(A) R196.1 R212.2
$1N64740: D38.1(K) R269.2
$1N65275: D41.2(A) R199.1 R213.2
$1N65277: D40.1(K) R270.2
$1N65545: D43.2(A) R202.1 R214.2
$1N65547: D42.1(K) R271.2
$1N65815: D45.2(A) R205.1 R215.2
$1N65817: D44.1(K) R272.2
$1N66085: D47.2(A) R208.1 R216.2
$1N66087: D46.1(K) R273.2
$1N66355: D49.2(A) R211.1 R217.2
$1N66357: D48.1(K) R274.2
$1N84396: Q204.3(C) R101.1
$1N84443: Q205.1(B) R99.1
$1N84445: Q205.3(C) R100.1
$1N84660: Q210.3(C) R108.1
$1N84707: Q211.1(B) R106.1
$1N84709: Q211.3(C) R107.1
$1N84795: Q213.3(C) R116.1
$1N84968: Q217.1(B) R114.1
$1N84970: Q217.3(C) R115.1
$1N85146: Q221.3(C) R95.1
$1N85193: Q222.1(B) R93.1
$1N85195: Q222.3(C) R94.1
$1N85239: Q223.3(C) R90.1
$1N85373: Q226.1(B) R81.1
$1N85375: Q226.3(C) R82.1
$1N85419: Q227.3(C) R83.1
$1N85469: Q228.1(B) R123.1
$1N85471: Q228.3(C) R124.1
$1N85819: Q225.1(B) R88.1
$1N85821: Q225.3(C) R89.1
$1N85824: Q229.3(C) R125.1
$1N85829: Q234.2(E) Q235.3(C)
$1N86427: Q245.3(C) R194.1
$1N86477: Q246.3(C) R212.1
$1N86527: Q247.3(C) R213.1
$1N86577: Q248.3(C) R214.1
$1N86627: Q249.3(C) R215.1
$1N86677: Q250.3(C) R216.1
$1N86727: Q251.3(C) R217.1
$1N86766: Q244.1(B) R267.1
$1N86805: Q245.1(B) R268.1
$1N86844: Q246.1(B) R269.1
$1N86883: Q247.1(B) R270.1
$1N86922: Q248.1(B) R271.1
$1N86961: Q249.1(B) R272.1
$1N87000: Q250.1(B) R273.1
$1N87039: Q251.1(B) R274.1
$2N3494: Q164.3(C) Q167.3(C) Q168.3(C) Q169.3(C) Q170.3(C) Q171.3(C) Q174.3(C) Q175.3(C) Q176.3(C) Q177.3(C) Q179.3(C) Q180.3(C) Q181.3(C) Q182.3(C) Q183.3(C) Q185.3(C) Q186.3(C) Q187.3(C) Q188.3(C) Q189.3(C) Q190.3(C) Q192.3(C) Q193.3(C) Q194.3(C) Q195.3(C) Q196.3(C) Q197.3(C) Q198.3(C) R259.2
$2N3495: Q169.2(E) Q170.2(E) Q171.2(E) Q172.3(C)
$2N3497: Q173.1(B) R249.2
$2N3499: Q172.1(B) R253.2
$2N3506: Q259.1(B) R259.1
$2N3510: Q166.3(C) Q167.2(E) Q168.2(E)
$2N3513: Q165.1(B) R258.2
$2N3515: Q166.1(B) R256.2
$2N3520: Q164.2(E) Q165.3(C)
$2N3526: Q178.3(C) Q179.2(E) Q180.2(E) Q181.2(E) Q182.2(E) Q183.2(E)
$2N3529: Q184.3(C) Q185.2(E) Q186.2(E) Q187.2(E) Q188.2(E) Q189.2(E) Q190.2(E)
$2N3538: Q191.3(C) Q192.2(E) Q193.2(E) Q194.2(E) Q195.2(E) Q196.2(E) Q197.2(E) Q198.2(E)
$2N3547: Q184.1(B) R237.2
$2N3551: Q191.1(B) R238.2
$2N3557: Q173.3(C) Q174.2(E) Q175.2(E) Q176.2(E) Q177.2(E)
$2N3569: Q178.1(B) R244.2
$2N10447: R180.1 R181.2 U18.3(IN+)
$2N10452: R177.1 R178.2 U17.3(IN+)
$2N10457: R174.1 R175.2 U16.3(IN+)
$2N10464: R171.1 R172.2 U15.3(IN+)
$2N10475: R186.1 R187.2 U20.3(IN+)
$2N10490: R183.1 R184.2 U19.3(IN+)
$2N10501: R189.1 R190.2 U21.3(IN+)
$2N14263: D50.1(K) D51.1(K) D52.1(K) U24.3(IN+)
$2N18109: Q199.3(C) Q260.1(B)
$2N29880: Q164.1(B) R257.1
$2N30008: Q167.1(B) R255.1
$2N30053: Q168.1(B) R254.1
$2N30097: Q169.1(B) R252.1
$2N30141: Q170.1(B) R251.1
$2N30186: Q171.1(B) R250.1
$2N30316: Q174.1(B) R248.1
$2N30360: Q175.1(B) R247.1
$2N30405: Q176.1(B) R246.1
$2N30450: Q177.1(B) R245.1
$2N30537: Q179.1(B) R239.1
$2N30581: Q180.1(B) R240.1
$2N30626: Q181.1(B) R241.1
$2N30671: Q182.1(B) R242.1
$2N30716: Q183.1(B) R243.1
$2N30803: Q185.1(B) R236.1
$2N30847: Q186.1(B) R234.1
$2N30892: Q187.1(B) R235.1
$2N30937: Q188.1(B) R233.1
$2N30982: Q189.1(B) R232.2
$2N31114: Q192.1(B) R224.1
$2N31158: Q193.1(B) R225.1
$2N31203: Q194.1(B) R226.1
$2N31248: Q195.1(B) R227.1
$2N31293: Q196.1(B) R228.1
$2N31338: Q197.1(B) R229.1
$2N31383: Q198.1(B) R230.1
$2N31428: Q190.1(B) R231.1
$2N31472: Q199.1(B) R219.2
$2N31519: Q200.1(B) R222.2
$2N31521: Q199.2(E) Q200.3(C)
$2N31571: Q252.3(C) R172.1
$2N31621: Q253.3(C) R175.1
$2N31671: Q254.3(C) R178.1
$2N31721: Q255.3(C) R181.1
$2N31771: Q256.3(C) R184.1
$2N31821: Q257.3(C) R187.1
$2N31871: Q258.3(C) R190.1
$2N31913: Q258.1(B) R260.2
$2N31992: Q256.1(B) R262.2
$2N32034: Q255.1(B) R263.2
$2N32039: Q257.1(B) R261.2
$2N32081: Q254.1(B) R264.2
$2N32165: Q252.1(B) R266.2
$2N39567: Q253.1(B) R275.2
